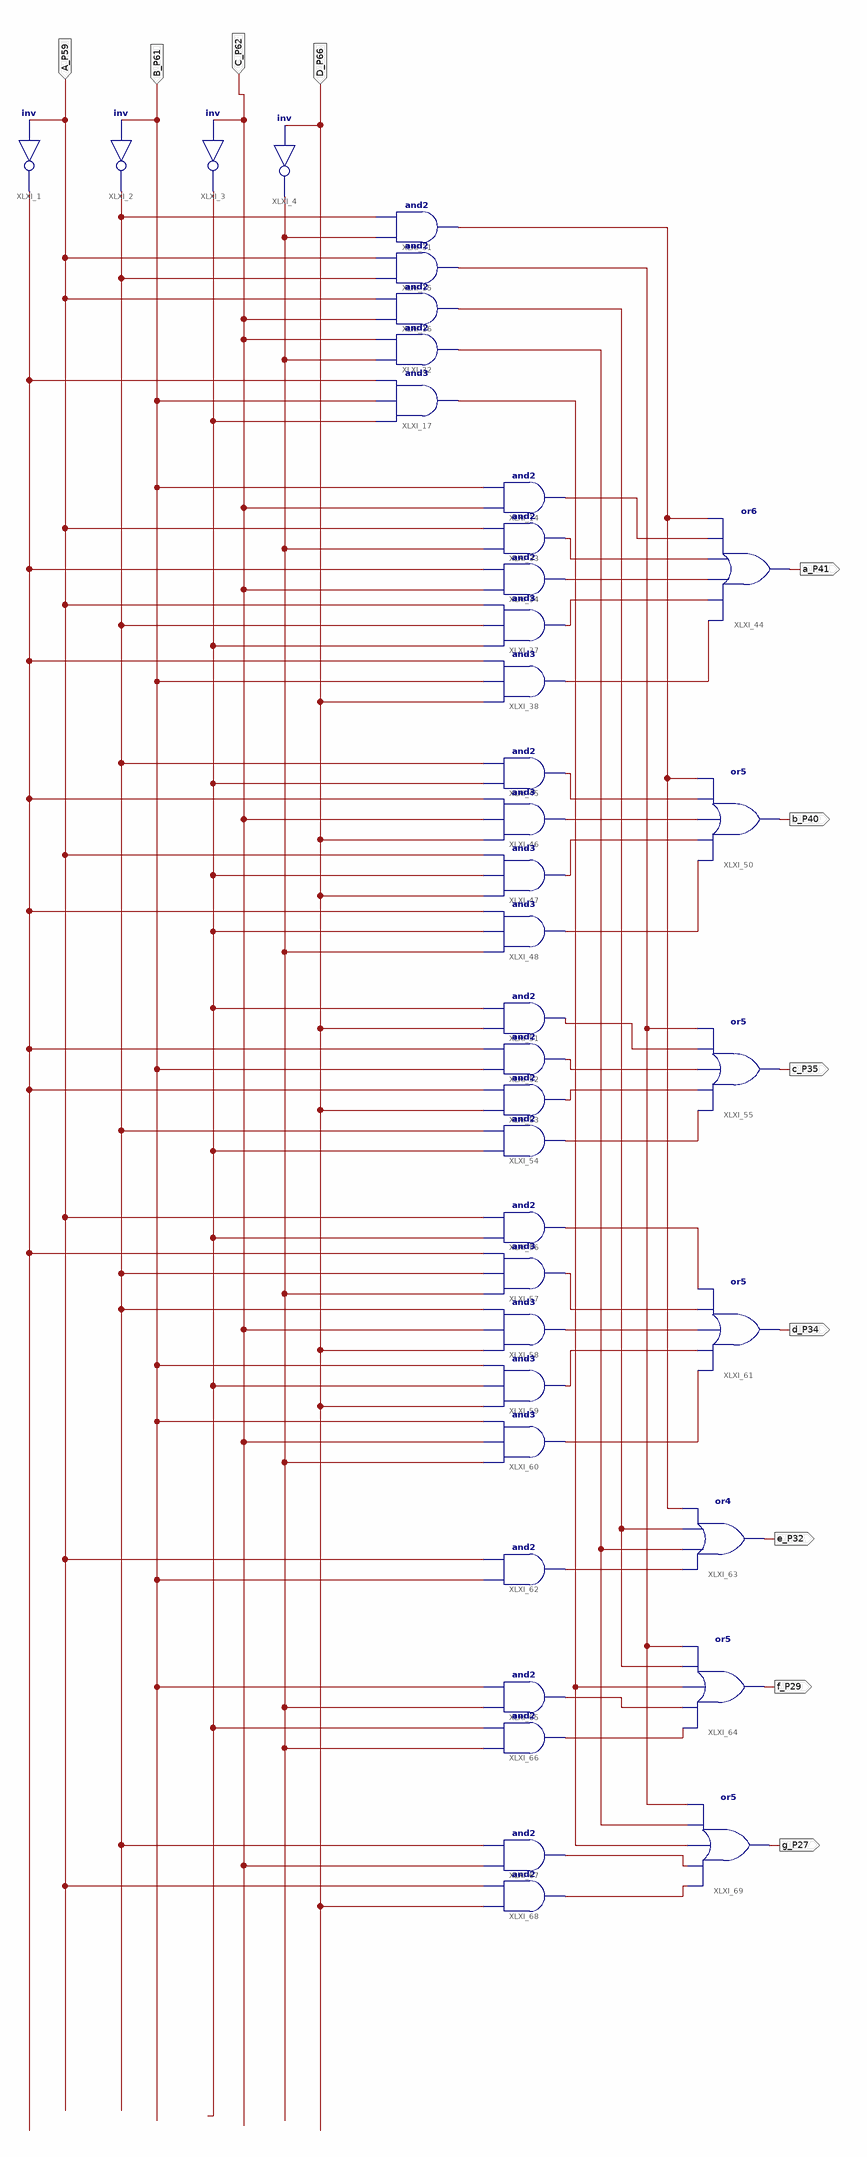
[diagram p0: schematic sheet 1]
// Xilinx ISE schematic bcdto7seg.sch (spartan6) as structural Verilog: 39 symbols, 11 ports
module bcdto7seg (
  input  B_P61,
  input  C_P62,
  input  D_P66,
  input  A_P59,
  output a_P41,
  output b_P40,
  output c_P35,
  output d_P34,
  output e_P32,
  output f_P29,
  output g_P27
);

  wire XLXN_6, XLXN_13, XLXN_15, XLXN_17, XLXN_39, XLXN_40, XLXN_41, XLXN_42, XLXN_44, XLXN_60, XLXN_61,
       XLXN_62, XLXN_64, XLXN_65, XLXN_72, XLXN_73, XLXN_74, XLXN_75, XLXN_84, XLXN_91, XLXN_92, XLXN_93,
       XLXN_94, XLXN_95, XLXN_102, XLXN_106, XLXN_107, XLXN_110, XLXN_111, XLXN_117, XLXN_124, XLXN_125;

  not XLXI_4 (XLXN_17, D_P66);
  not XLXI_3 (XLXN_15, C_P62);
  not XLXI_2 (XLXN_13, B_P61);
  not XLXI_1 (XLXN_6, A_P59);
  and XLXI_17 (XLXN_117, XLXN_15, B_P61, XLXN_6);
  and XLXI_15 (XLXN_84, XLXN_13, A_P59);
  and XLXI_16 (XLXN_106, C_P62, A_P59);
  and XLXI_31 (XLXN_65, XLXN_17, XLXN_13);
  and XLXI_32 (XLXN_107, XLXN_17, C_P62);
  and XLXI_14 (XLXN_44, C_P62, B_P61);
  and XLXI_33 (XLXN_42, XLXN_17, A_P59);
  and XLXI_34 (XLXN_41, C_P62, XLXN_6);
  and XLXI_37 (XLXN_40, XLXN_15, XLXN_13, A_P59);
  and XLXI_38 (XLXN_39, D_P66, B_P61, XLXN_6);
  or XLXI_44 (a_P41, XLXN_39, XLXN_40, XLXN_41, XLXN_42, XLXN_44, XLXN_65);
  and XLXI_45 (XLXN_60, XLXN_15, XLXN_13);
  and XLXI_46 (XLXN_61, D_P66, C_P62, XLXN_6);
  and XLXI_47 (XLXN_62, D_P66, XLXN_15, A_P59);
  and XLXI_48 (XLXN_64, XLXN_17, XLXN_15, XLXN_6);
  or XLXI_50 (b_P40, XLXN_64, XLXN_62, XLXN_61, XLXN_60, XLXN_65);
  and XLXI_51 (XLXN_75, D_P66, XLXN_15);
  and XLXI_52 (XLXN_74, B_P61, XLXN_6);
  and XLXI_53 (XLXN_73, D_P66, XLXN_6);
  and XLXI_54 (XLXN_72, XLXN_15, XLXN_13);
  or XLXI_55 (c_P35, XLXN_72, XLXN_73, XLXN_74, XLXN_75, XLXN_84);
  and XLXI_56 (XLXN_92, XLXN_15, A_P59);
  and XLXI_57 (XLXN_93, XLXN_17, XLXN_13, XLXN_6);
  and XLXI_58 (XLXN_91, D_P66, C_P62, XLXN_13);
  and XLXI_59 (XLXN_94, D_P66, XLXN_15, B_P61);
  and XLXI_60 (XLXN_95, XLXN_17, C_P62, B_P61);
  or XLXI_61 (d_P34, XLXN_95, XLXN_94, XLXN_91, XLXN_93, XLXN_92);
  and XLXI_62 (XLXN_102, B_P61, A_P59);
  or XLXI_63 (e_P32, XLXN_102, XLXN_107, XLXN_106, XLXN_65);
  and XLXI_65 (XLXN_111, XLXN_17, B_P61);
  and XLXI_66 (XLXN_110, XLXN_17, XLXN_15);
  and XLXI_67 (XLXN_125, C_P62, XLXN_13);
  and XLXI_68 (XLXN_124, D_P66, A_P59);
  or XLXI_64 (f_P29, XLXN_110, XLXN_111, XLXN_117, XLXN_106, XLXN_84);
  or XLXI_69 (g_P27, XLXN_124, XLXN_125, XLXN_117, XLXN_107, XLXN_84);
endmodule
